# Altium schematic sheet Main.SchDoc: Main
size A4; DocumentNumber: 1; Revision: 0v1; SheetNumber: 1; SheetTotal: 9
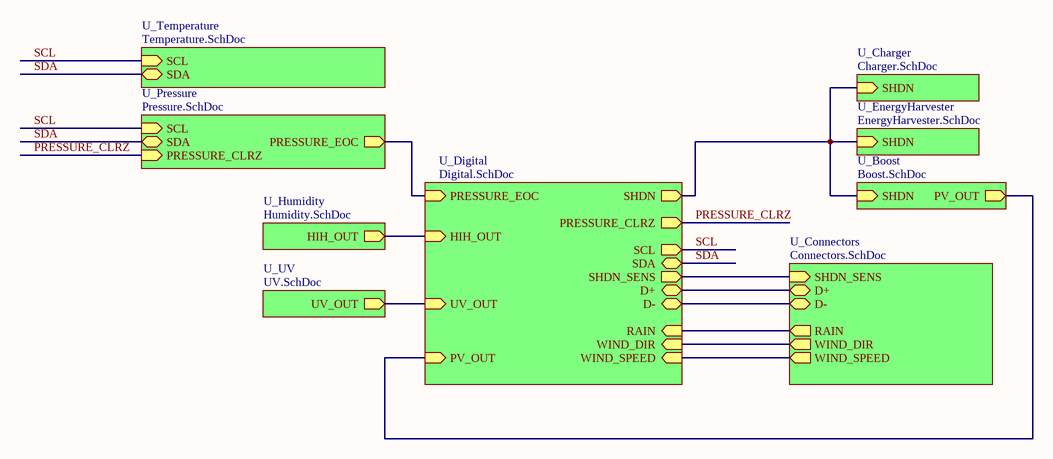
[diagram p0: Main.SchDoc]

## Sub-sheets
U_Boost = Boost.SchDoc: SHDN (in), PV_OUT (out)
U_Charger = Charger.SchDoc: SHDN (in)
U_Connectors = Connectors.SchDoc: RAIN (out), WIND_DIR (out), WIND_SPEED (out), SHDN_SENS (in), D+ (bidir), D- (bidir)
U_Digital = Digital.SchDoc: RAIN (in), WIND_DIR (in), WIND_SPEED (in), SHDN (out), SCL (out), SDA (bidir), PRESSURE_EOC (in), PRESSURE_CLRZ (out), HIH_OUT (in), UV_OUT (in), PV_OUT (in), SHDN_SENS (out), D+ (bidir), D- (bidir)
U_EnergyHarvester = EnergyHarvester.SchDoc: SHDN (in)
U_Humidity = Humidity.SchDoc: HIH_OUT (out)
U_Pressure = Pressure.SchDoc: SCL (in), SDA (bidir), PRESSURE_EOC (out), PRESSURE_CLRZ (in)
U_Temperature = Temperature.SchDoc: SCL (in), SDA (bidir)
U_UV = UV.SchDoc: UV_OUT (out)

## Nets
PRESSURE_CLRZ: sheet U_Pressure/PRESSURE_CLRZ, sheet U_Digital/PRESSURE_CLRZ
SCL: sheet U_Pressure/SCL, sheet U_Temperature/SCL, sheet U_Digital/SCL
SDA: sheet U_Pressure/SDA, sheet U_Temperature/SDA, sheet U_Digital/SDA
(unnamed): sheet U_Boost/SHDN, sheet U_Charger/SHDN, sheet U_EnergyHarvester/SHDN, sheet U_Digital/SHDN
(unnamed): sheet U_Boost/PV_OUT, sheet U_Digital/PV_OUT
(unnamed): sheet U_Humidity/HIH_OUT, sheet U_Digital/HIH_OUT
(unnamed): sheet U_Pressure/PRESSURE_EOC, sheet U_Digital/PRESSURE_EOC
(unnamed): sheet U_UV/UV_OUT, sheet U_Digital/UV_OUT
(unnamed): sheet U_Connectors/RAIN, sheet U_Digital/RAIN
(unnamed): sheet U_Connectors/WIND_DIR, sheet U_Digital/WIND_DIR
(unnamed): sheet U_Connectors/WIND_SPEED, sheet U_Digital/WIND_SPEED
(unnamed): sheet U_Connectors/SHDN_SENS, sheet U_Digital/SHDN_SENS
(unnamed): sheet U_Connectors/D+, sheet U_Digital/D+
(unnamed): sheet U_Connectors/D-, sheet U_Digital/D-

## Notes on the sheet
- Title
- Size:
- Date:
- A4
- Number:
- Time:
- Revision:
- Sheet
- of
- File: